# Altium schematic sheet [06] ULTRA WIDEBAND.SchDoc: Template
size A4; Author: Hom; CompanyName: KitSprout; DrawnBy: Hom; Engineer: Hom; Organization: KitSprout; Revision: A; SheetNumber: 6; SheetTotal: 6; Version: 0.0; LibVersion: 0.0
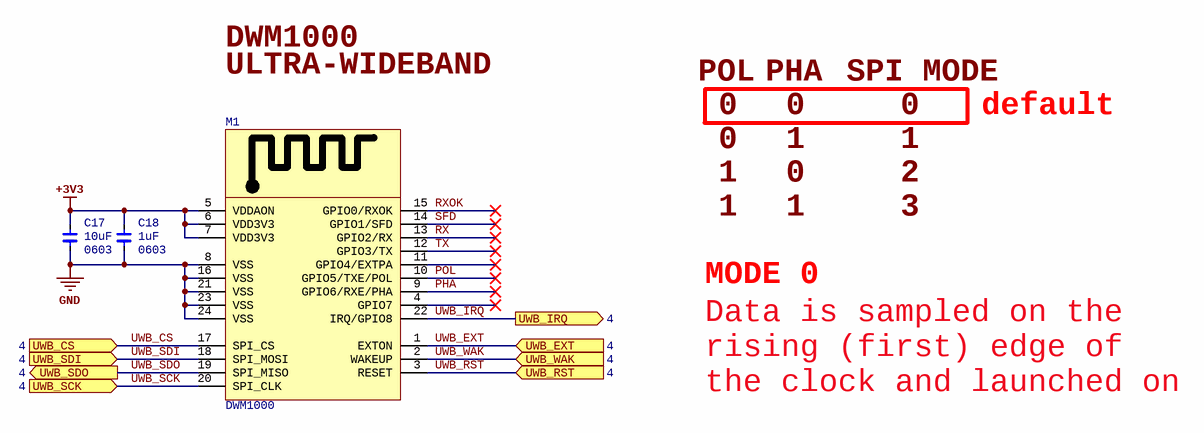
[diagram p0: [06] ULTRA WIDEBAND.SchDoc]

## Parts
C17  Type: 0603  [CAP_0603]  (hidden comment: 10uF)
C18  Type: 0603  [CAP_0603]  (hidden comment: 1uF)
M1  DWM1000  [DWM1000]

## Ports
UWB_CS (in, see 4), UWB_EXT (in, see 4), UWB_IRQ (out, see 4), UWB_RST (in, see 4), UWB_SCK (in, see 4), UWB_SDI (in, see 4), UWB_SDO (out, see 4), UWB_WAK (in, see 4)

## Nets
+3V3: C17.2 C18.2 M1.5(VDDAON) M1.6(VDD3V3) M1.7(VDD3V3)
GND: C17.1 C18.1 M1.8(VSS) M1.16(VSS) M1.21(VSS) M1.23(VSS) M1.24(VSS)
PHA: M1.9(GPIO6/RXE/PHA)
POL: M1.10(GPIO5/TXE/POL)
RX: M1.13(GPIO2/RX)
RXOK: M1.15(GPIO0/RXOK)
SFD: M1.14(GPIO1/SFD)
TX: M1.12(GPIO3/TX)
UWB_CS: M1.17(SPI_CS) ; port UWB_CS
UWB_EXT: M1.1(EXTON) ; port UWB_EXT
UWB_IRQ: M1.22(IRQ/GPIO8) ; port UWB_IRQ
UWB_RST: M1.3(RESET) ; port UWB_RST
UWB_SCK: M1.20(SPI_CLK) ; port UWB_SCK
UWB_SDI: M1.18(SPI_MOSI) ; port UWB_SDI
UWB_SDO: M1.19(SPI_MISO) ; port UWB_SDO
UWB_WAK: M1.2(WAKEUP) ; port UWB_WAK

Not connected (* = marked no-connect by the designer): M1 4(GPIO7)* 11(GPIO4/EXTPA)*

## Notes on the sheet
- ULTRA-WIDEBAND
- DWM1000
- POL
- PHA
- SPI MODE
- 0
- 1
- default
- 2
- 3
- MODE 0
- Data is sampled on the rising (first) edge of the clock and launched on the falling (second) edge.

## Library data of the parts
C17 C18 = Cap_0603: Capacitor
  C17: Value: 10uF
  C18: Value: 1uF
M1 = DWM1000: Module; Manufacturer: Decawave Limited; Frequency: 3.5GHz ~ 6.5GHz; Data Rate: 6.8Mbps; Serial Interfaces: SPI; Antenna Type: Integrated, Chip; Voltage - Supply: 2.8 V ~ 3.6 V; Current - Receiving: 64mA; Current - Transmitting: 31mA; Supplier 1: Digi-Key; Manufacturer Part Number: DWM1000; RoHS: RoHS Compliant; Category: RF/IF and RFID; Stock 1: 1028; Pricing 1: 1=32.16, 10=26.704, 100=24.24, 250=22.51296 (USD); Packaging: Cut Tape (CT); RF Family/Standard: 802.15.4; Protocol: -; Modulation: -; Power - Output: -; Sensitivity: -; Memory Size: -; Mounting Type: Surface Mount; Operating Temperature: -40°C ~ 85°C; Package / Case: Module; ComponentLink1URL: http://www.decawave.com/sites/default/files/product-pdf/dwm1000-product-brief.pdf; ComponentLink1Description: http://www.decawave.com/sites/default/files/product-pdf/dwm1000-product-brief.pdf; Supplier Part Number 1: 1479-1002-1-ND